# EAGLE design Netzteil (EAGLE 7.2.0)
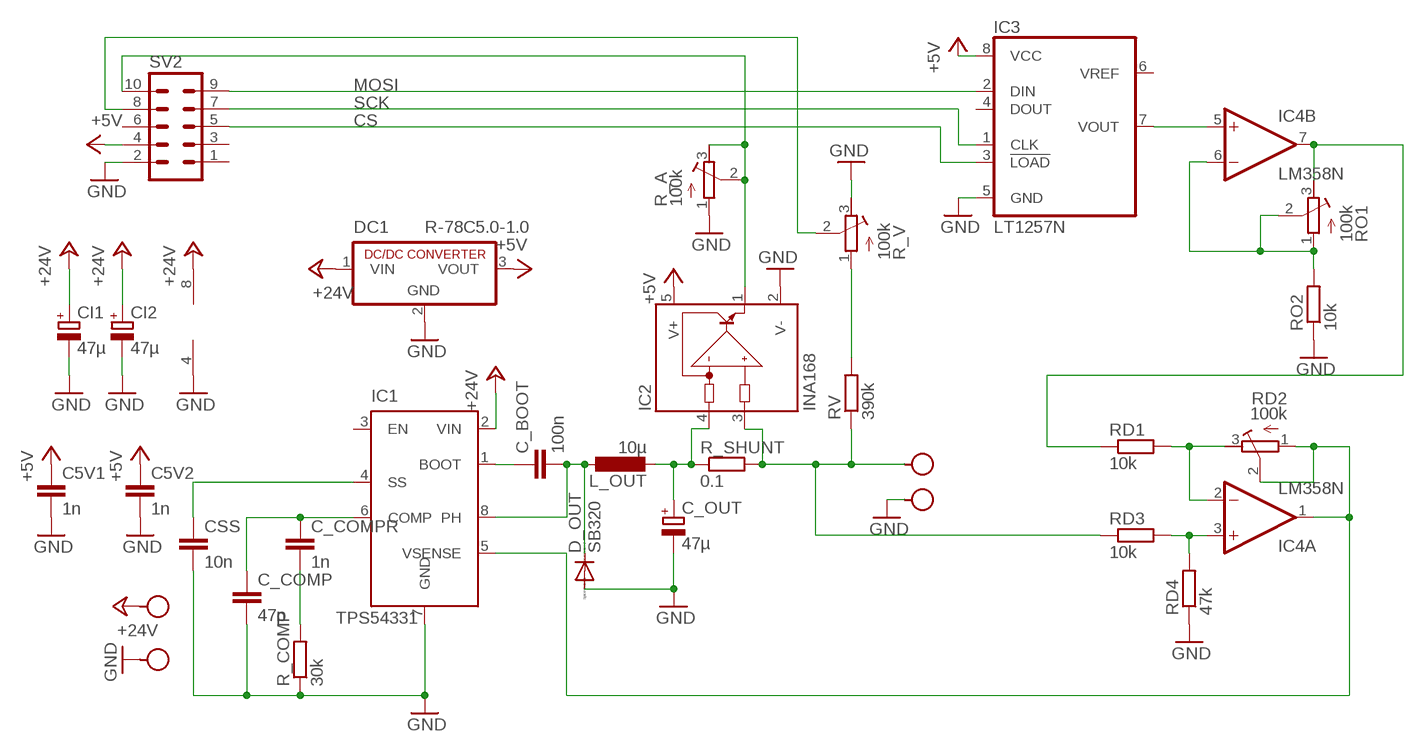
[diagram p0: schematic, sheet 1]

## Parts
C5V1  1n  C-EU025-025X050  [C025-025X050]
C5V2  1n  C-EU025-025X050  [C025-025X050]
C_BOOT  100n  C-EU025-025X050  [C025-025X050]
C_COMP  47p  C-EU025-025X050  [C025-025X050]
C_COMPR  1n  C-EU025-025X050  [C025-025X050]
C_OUT  47µ  CPOL-EUE2.5-6  [E2,5-6]
CI1  47µ  CPOL-EUE2.5-6  [E2,5-6]
CI2  47µ  CPOL-EUE2.5-6  [E2,5-6]
CSS  10n  C-EU025-025X050  [C025-025X050]
D_OUT  SB320  [DO201-15]
DC1  R-78C5.0-1.0  [SIP3]
H1  SEW_HOLE-SMALL  [SIMPLE_HOLE_SM]
H2  SEW_HOLE-SMALL  [SIMPLE_HOLE_SM]
H3  SEW_HOLE-SMALL  [SIMPLE_HOLE_SM]
H4  SEW_HOLE-SMALL  [SIMPLE_HOLE_SM]
IC1  TPS54331  TPS5410  [D_R-PDSO-G08]
IC2  INA168  [SOT23-5]
IC3  LT1257N  [DIL08]
IC4  LM358N  [DIL08]
L_OUT  10µ  L-EUPIS2816  [PIS2816]
R_A  100k  R-TRIMM64Y  [RTRIM64Y]
R_COMP  30k  R-EU_0309/12  [0309/12]
R_SHUNT  0.1  R-EU_0817/22  [P0817/22]
R_V  100k  R-TRIMM64Y  [RTRIM64Y]
RD1  10k  R-EU_0309/12  [0309/12]
RD2  100k  R-TRIMM64Y  [RTRIM64Y]
RD3  10k  R-EU_0309/12  [0309/12]
RD4  47k  R-EU_0309/12  [0309/12]
RO1  100k  R-TRIMM64Y  [RTRIM64Y]
RO2  10k  R-EU_0309/12  [0309/12]
RV  390k  R-EU_0309/12  [0309/12]
SV2  ML10  [ML10]

## Nets
+5V: C5V1.1 C5V2.1 DC1.3(VOUT) IC2.5(V+) IC3.8(VCC) SV2.4
+24V [Strom]: CI1.+ CI2.+ DC1.1(VIN) H3.P$1 IC1.2(VIN) IC4.8(P:V+)
CS: IC3.3(!LOAD) SV2.5
GND: C5V1.2 C5V2.2 C_COMP.2 C_OUT.- CI1.- CI2.- CSS.2 D_OUT.A DC1.2(GND) H2.P$1 H4.P$1 IC1.7(GND) IC2.2(V-) IC3.5(GND) IC4.4(P:V-) R_A.1(E) R_COMP.1 R_V.3(A) RD4.1 RO2.1 SV2.2
MOSI: IC3.2(DIN) SV2.9
N$1 [Strom]: C_OUT.+ IC2.4(IN-) L_OUT.2 R_SHUNT.1
N$2 [Strom]: C_BOOT.2 D_OUT.C IC1.8(PH) L_OUT.1
N$3 [Strom]: C_BOOT.1 IC1.1(BOOT)
N$4: IC4.7(B:OUT) RD1.1 RO1.3(A)
N$5: C_COMPR.2 R_COMP.2
N$6 [Strom]: H1.P$1 IC2.3(IN+) R_SHUNT.2 RD3.1 RV.1
N$7: C_COMP.1 C_COMPR.1 IC1.6(COMP)
N$8: CSS.1 IC1.4(SS)
N$9: R_V.1(E) RV.2
N$10: R_V.2(S) SV2.8
N$11: IC1.5(VSENSE) IC4.1(A:OUT) RD2.1(E) RD2.2(S)
N$12: IC3.7(VOUT) IC4.5(B:+IN)
N$13: IC4.6(B:-IN) RO1.1(E) RO1.2(S) RO2.2
N$14: IC4.2(A:-IN) RD1.2 RD2.3(A)
N$16: IC4.3(A:+IN) RD3.2 RD4.2
N$17: IC2.1(OUT) R_A.2(S) R_A.3(A) SV2.10
SCK: IC3.1(CLK) SV2.7
Unconnected: IC1.3(EN) IC3.4(DOUT) IC3.6(VREF) SV2.1 SV2.3 SV2.6

## Library data of the parts
C5V1 C5V2 C_BOOT C_COMP C_COMPR CSS = rcl:C-EU: CAPACITOR, European symbol; OC_FARNELL: unknown
C_OUT CI1 CI2 = resistor:CPOL-EU: POLARIZED CAPACITOR, European symbol; OC_FARNELL: unknown
D_OUT = diode:SB320: DIODE barrier rectifier, 3 A (Fairchild); OC_FARNELL: unknown
DC1 = dc-dc-converter:R-78C*-1.0: INNOLINE DC/DC-Converter 1.0 AMP SIP3 Single Output Source: Data sheet <http://www.mikrocontroller.net/attachment/150645/157764-da-01-en-DC_DC_WANDLER_R_78C5_0_1_0.pdf>; MF: RECOM POWER; MPN: R-78C5.0-1.0; OC_FARNELL: 1903040
H1-H4 = LilyPad-Wearables:SEW_HOLE-SMALL: .070" hole with 20mil annular ring; OC_FARNELL: unknown
IC1 = TPS54331:TPS5410: 1-A, WIDE INPUT RANGE, STEP-DOWN SWIFT? CONVERTER Source: U7 Texas TPS5410 Step Down Converter.pdf; MF: TEXAS INSTRUMENTS; MPN: TPS5410DG4; OC_FARNELL: 1329596; OC_NEWARK: 18M3223
IC2 = burr-brown:INA168: High-Side Measurement Current Shunt Monitor; MF: TEXAS INSTRUMENTS; MPN: INA168NA/250; OC_FARNELL: 4375737; OC_NEWARK: 35C1744
IC3 = linear-technology:LT1257: Complete Single Supply 12-Bit Voltage Output DAC Source: http://www.linear.com/pc/downloadDocument.do?navId=H0,C1,C1155,C1005,C1156,P1425,D3414; OC_FARNELL: unknown; OC_NEWARK: unknown
IC4 = linear:LM358: OP AMP also LM158; LM258; LM2904 Source: http://cache.national.com/ds/LM/LM158.pdf
L_OUT = rcl:L-EU: INDUCTOR, European symbol
R_A R_V RD2 RO1 = resistor:R-TRIMM: Trimm resistor
R_COMP R_SHUNT RD1 RD3 RD4 RO2 RV = rcl:R-EU_: RESISTOR, European symbol; OC_FARNELL: unknown
SV2 = con-ml:ML10: HARTING; OC_FARNELL: unknown; OC_NEWARK: unknown

## Net classes
1 Strom: width 0.762 mm

## Board
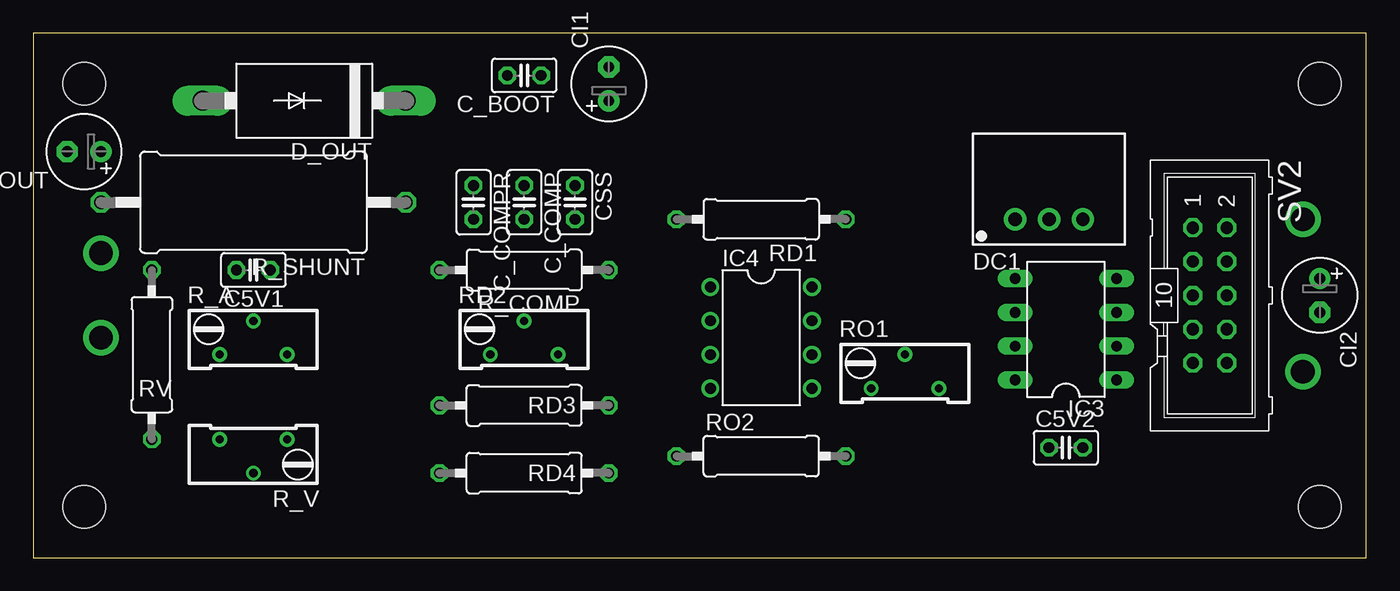
[diagram p1: board, top side]
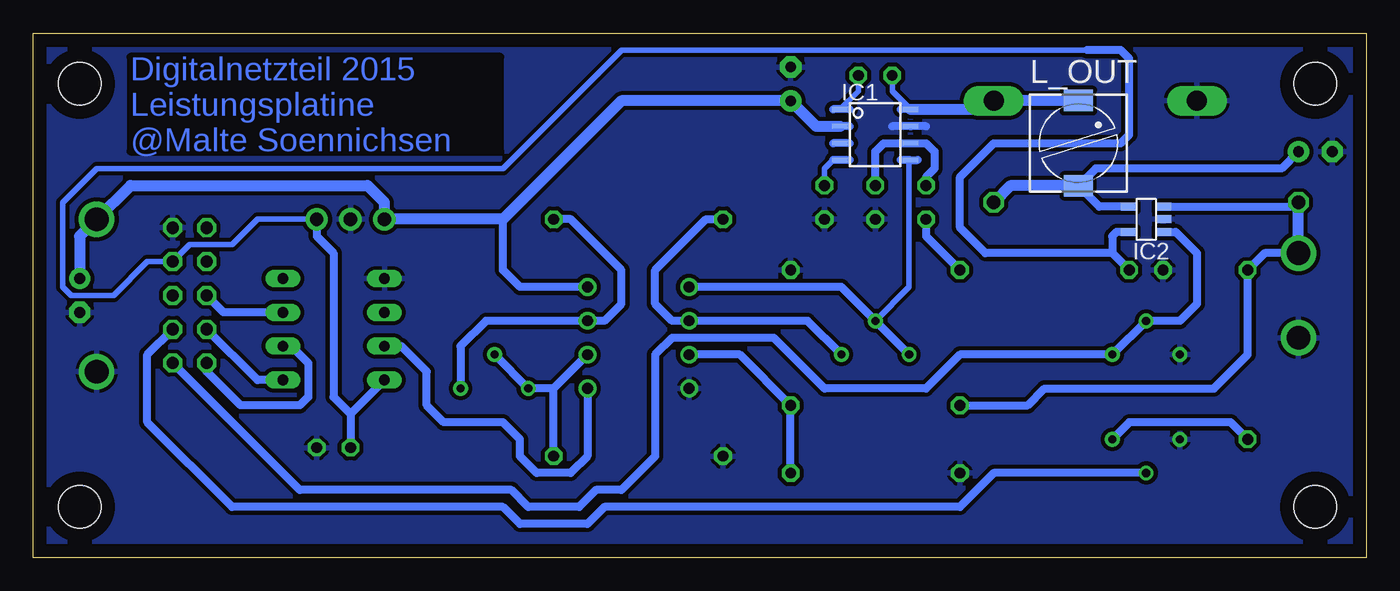
[diagram p2: board, bottom side, seen from below]

Size 100 x 39.36 mm. Coordinates in mm from the lower left corner, seen from the top.
Outline: 0,0 100,0 100,39.36 0,39.36 0,0
Copper layers 16: Bottom 0.035mm
Design rules "default *": minimum track width 12mil, minimum drill 24mil, track to track 12mil, track to pad 12mil, pad to pad 12mil, via to via 12mil, smd to smd 12mil, copper to edge 40mil, drill to drill 8mil, minimum pad ring 10mil, minimum via ring 8mil, stop-mask expansion 4mil, vias tented up to drill 0mil, thermal gap 10mil
Holes 3.2 mm at 3.81,3.81 96.52,3.81 96.52,35.56 3.81,35.56

### Footprints (pad centres in the part's own frame; a part is rotated, then mirrored left to right if it is on the bottom)
C025-025X050 = drill 0.813 octagon: 1 -1.27,0; 2 1.27,0
E2,5-6 = drill 0.813 pad 1.6: + -1.27,0 | drill 0.813 pad 1.6 octagon: - 1.27,0
DO201-15 = drill 1.499 long: A 7.62,0; C -7.62,0
SIP3 = drill 1 pad 1.676: 1 -2.54,0; 2 0,0; 3 2.54,0
SIMPLE_HOLE_SM = drill 1.778 pad 2.286: P$1 0,0
D_R-PDSO-G08 = smd 0.4 x 1.2: 1 -1.905,-2.65; 2 -0.635,-2.65; 3 0.635,-2.65; 4 1.905,-2.65; 5 1.905,2.65; 6 0.635,2.65; 7 -0.635,2.65; 8 -1.905,2.65
SOT23-5 = smd 0.6 x 1.2: 1 -0.95,-1.306; 2 0,-1.306; 3 0.95,-1.306; 4 0.95,1.306; 5 -0.95,1.306
DIL08 = drill 0.813 long: 1 -3.81,-3.81; 2 -1.27,-3.81; 3 1.27,-3.81; 4 3.81,-3.81; 5 3.81,3.81; 6 1.27,3.81; 7 -1.27,3.81; 8 -3.81,3.81
DIL08' = drill 0.813 pad 1.27: 1 -3.81,-3.81; 2 -1.27,-3.81; 3 1.27,-3.81; 4 3.81,-3.81; 5 3.81,3.81; 6 1.27,3.81; 7 -1.27,3.81; 8 -3.81,3.81
PIS2816 = smd 2.2 x 1.6: 1 0,3.2; 2 0,-3.2
RTRIM64Y = drill 0.61: 1 0,-2.54; 2 -2.54,0; 3 0,2.54
0309/12 = drill 0.813 octagon: 1 -6.35,0; 2 6.35,0
P0817/22 = drill 1.016 octagon: 1 -11.43,0; 2 11.43,0
ML10 = drill 0.914 octagon: 1 -5.08,-1.27; 2 -5.08,1.27; 3 -2.54,-1.27; 4 -2.54,1.27; 5 0,-1.27; 6 0,1.27; 7 2.54,-1.27; 8 2.54,1.27; 9 5.08,-1.27; 10 5.08,1.27

### Placement (x,y rotation side)
C5V1  16.51,21.59 180 top
C5V2  77.47,8.26 0 top
C_BOOT  36.83,36.2 180 top
C_COMP  36.83,26.67 270 top
C_COMPR  33.02,26.67 270 top
C_OUT  3.81,30.48 180 top
CI1  43.18,35.56 90 top
CI2  96.52,19.68 270 top
CSS  40.64,26.67 270 top
D_OUT  20.32,34.29 180 top
DC1  76.2,25.4 0 top
H1  5.08,22.86 90 top
H2  5.08,16.51 90 top
H3  95.25,25.4 90 top
H4  95.25,13.97 90 top
IC1  36.83,31.75 270 bottom
IC2  16.51,25.4 90 bottom
IC3  77.47,17.14 90 top
IC4  LM358N  [DIL08']  54.61,16.51 270 top
L_OUT  21.59,31.11 0 bottom
R_A  16.51,15.24 270 top
R_COMP  36.83,21.59 180 top
R_SHUNT  16.51,26.67 180 top
R_V  16.51,8.89 90 top
RD1  54.61,25.4 180 top
RD2  36.83,15.24 270 top
RD3  36.83,11.43 0 top
RD4  36.83,6.35 0 top
RO1  65.41,12.7 270 top
RO2  54.61,7.62 0 top
RV  8.89,15.24 270 top
SV2  88.27,19.68 270 top

### Tracks (layer width: path | path; a pad name or v marks a point on that pad's centre or on a via)
+5V
  Bottom 0.406: DC1.3 83.19,25.4 85.09,23.5 88.27,23.5 SV2.4 91.44,22.23 93.98,19.68 97.16,19.68 97.79,20.32 97.79,26.67 95.25,29.21 64.77,29.21 55.88,38.1 20.95,38.1
  Bottom 0.61: 19.05,22.86 19.05,24.13 18.73,24.45 IC2.5 | 19.05,22.86 C5V1.1 | 19.05,22.86 28.57,22.86 30.48,24.77 30.48,28.57 27.94,31.11 18.41,31.11 17.78,31.75 17.78,37.47 18.41,38.1 20.95,38.1 | IC3.8 76.2,10.79 | 76.2,10.79 C5V2.1 | DC1.3 78.74,24.13 77.47,22.86 77.47,12.06 76.2,10.79
+24V
  Bottom 0.61: IC4.8 63.5,20.32 64.77,21.59 64.77,25.4
  Bottom 0.813: CI2.+ 96.52,24.13 H3.P$1 92.71,27.94 74.93,27.94 73.66,26.67 DC1.1 64.77,25.4 55.88,34.29 CI1.+ 41.27,32.38 IC1.2
CS
  Bottom 0.61: IC3.3 85.72,18.41 SV2.5
GND
  Bottom 0.61: 35.56,32.38 IC1.7 33.02,32.38
  pour Bottom (isolate 0.305): 0,39.37 100.33,39.37 100.33,0 0,0
MOSI
  Bottom 0.61: IC3.2 80.64,15.88 79.38,14.61 79.38,12.06 80.01,11.43 84.45,11.43 87,13.97 SV2.9
N$1
  Bottom 0.61: IC2.4 20.02,26.35 L_OUT.2 20.3,29.21 6.35,29.21 C_OUT.+
  Bottom 0.813: L_OUT.2 26.7,27.91 R_SHUNT.1
N$2
  Bottom 0.406: C_BOOT.2 35.56,35.03 IC1.8
  Bottom 0.61: 33.66,33.66 34.92,33.66
  Bottom 0.813: IC1.8 33.66,33.66 28.57,33.66 D_OUT.C 26.7,34.31 L_OUT.1
N$3
  Bottom 0.406: C_BOOT.1 38.1,35.03 IC1.1
N$4
  Bottom 0.61: RO1.3 67.94,15.88 66.04,17.78 IC4.7 57.15,17.78 55.88,19.05 55.88,21.59 59.69,25.4 RD1.1
N$5
  Bottom 0.61: C_COMPR.2 33.02,24.13 R_COMP.2
N$6
  Bottom 0.61: IC2.3 5.4,26.35 R_SHUNT.2 | H1.P$1 7.62,22.86 RV.1 8.89,15.24 11.43,12.7 24.13,12.7 25.4,11.43 RD3.1
  Bottom 0.813: H1.P$1 R_SHUNT.2
N$7
  Bottom 0.61: C_COMPR.1 33.02,28.57 32.38,29.21 32.38,30.48 33.02,31.11 IC1.6 36.2,31.11 36.83,30.48 C_COMP.1
N$8
  Bottom 0.406: IC1.4 40.01,29.84 40.64,29.21 CSS.1
  Bottom 0.61: 38.73,29.84 40.01,29.84
N$9
  Bottom 0.61: RV.2 10.16,10.16 17.78,10.16 R_V.1
N$10
  Bottom 0.61: SV2.8 91.44,15.24 91.44,10.16 85.09,3.81 64.77,3.81 63.5,2.54 58.42,2.54 57.15,3.81 30.48,3.81 27.94,6.35 R_V.2
N$11
  Bottom 0.406: IC1.5 34.29,29.84 34.29,20.32 RD2.2
  Bottom 0.61: RD2.1 RD2.2 39.37,20.32 IC4.1 | 34.92,29.84 34.29,29.84 33.66,29.84
N$12
  Bottom 0.61: IC4.5 58.42,7.62 59.69,6.35 62.23,6.35 63.5,7.62 63.5,8.89 64.77,10.16 69.22,10.16 70.48,11.43 70.48,13.97 72.39,15.88 IC3.7
N$13
  Bottom 0.61: IC4.6 60.96,12.7 | 60.96,12.7 RO1.1 RO1.2 | RO2.2 60.96,12.7
N$14
  Bottom 0.61: RD2.3 41.91,17.78 IC4.2 52.07,17.78 53.34,19.05 53.34,21.59 49.53,25.4 RD1.2
N$15
  Bottom 0.61: 38.73,31.11 40.01,31.11
N$16
  Bottom 0.61: RD4.2 RD3.2 46.99,15.24 IC4.3
N$17
  Bottom 0.61: IC2.1 14.29,24.45 12.7,22.86 12.7,19.05 13.97,17.78 R_A.2 R_A.3 30.48,15.24 33.02,12.7 40.64,12.7 44.45,16.51 52.07,16.51 53.34,15.24 53.34,7.62 55.88,5.08 57.78,5.08 59.05,3.81 62.87,3.81 64.14,5.08 80.01,5.08 SV2.10
N$18
  Bottom 0.61: 38.73,32.38 39.37,32.38
N$19
  Bottom 0.61: 38.73,33.66 40.01,33.66
SCK
  Bottom 0.61: IC3.1 83.19,13.34 SV2.7
(copper drawn outside any net)
  shapes: Bottom area x2

### Text on the board
Bottom: Digitalnetzteil 2015 / Leistungsplatine / @Malte Soennichsen